# Altium schematic sheet 06-POWER SEQUENCE.SchDoc
size 513 x 386 mm
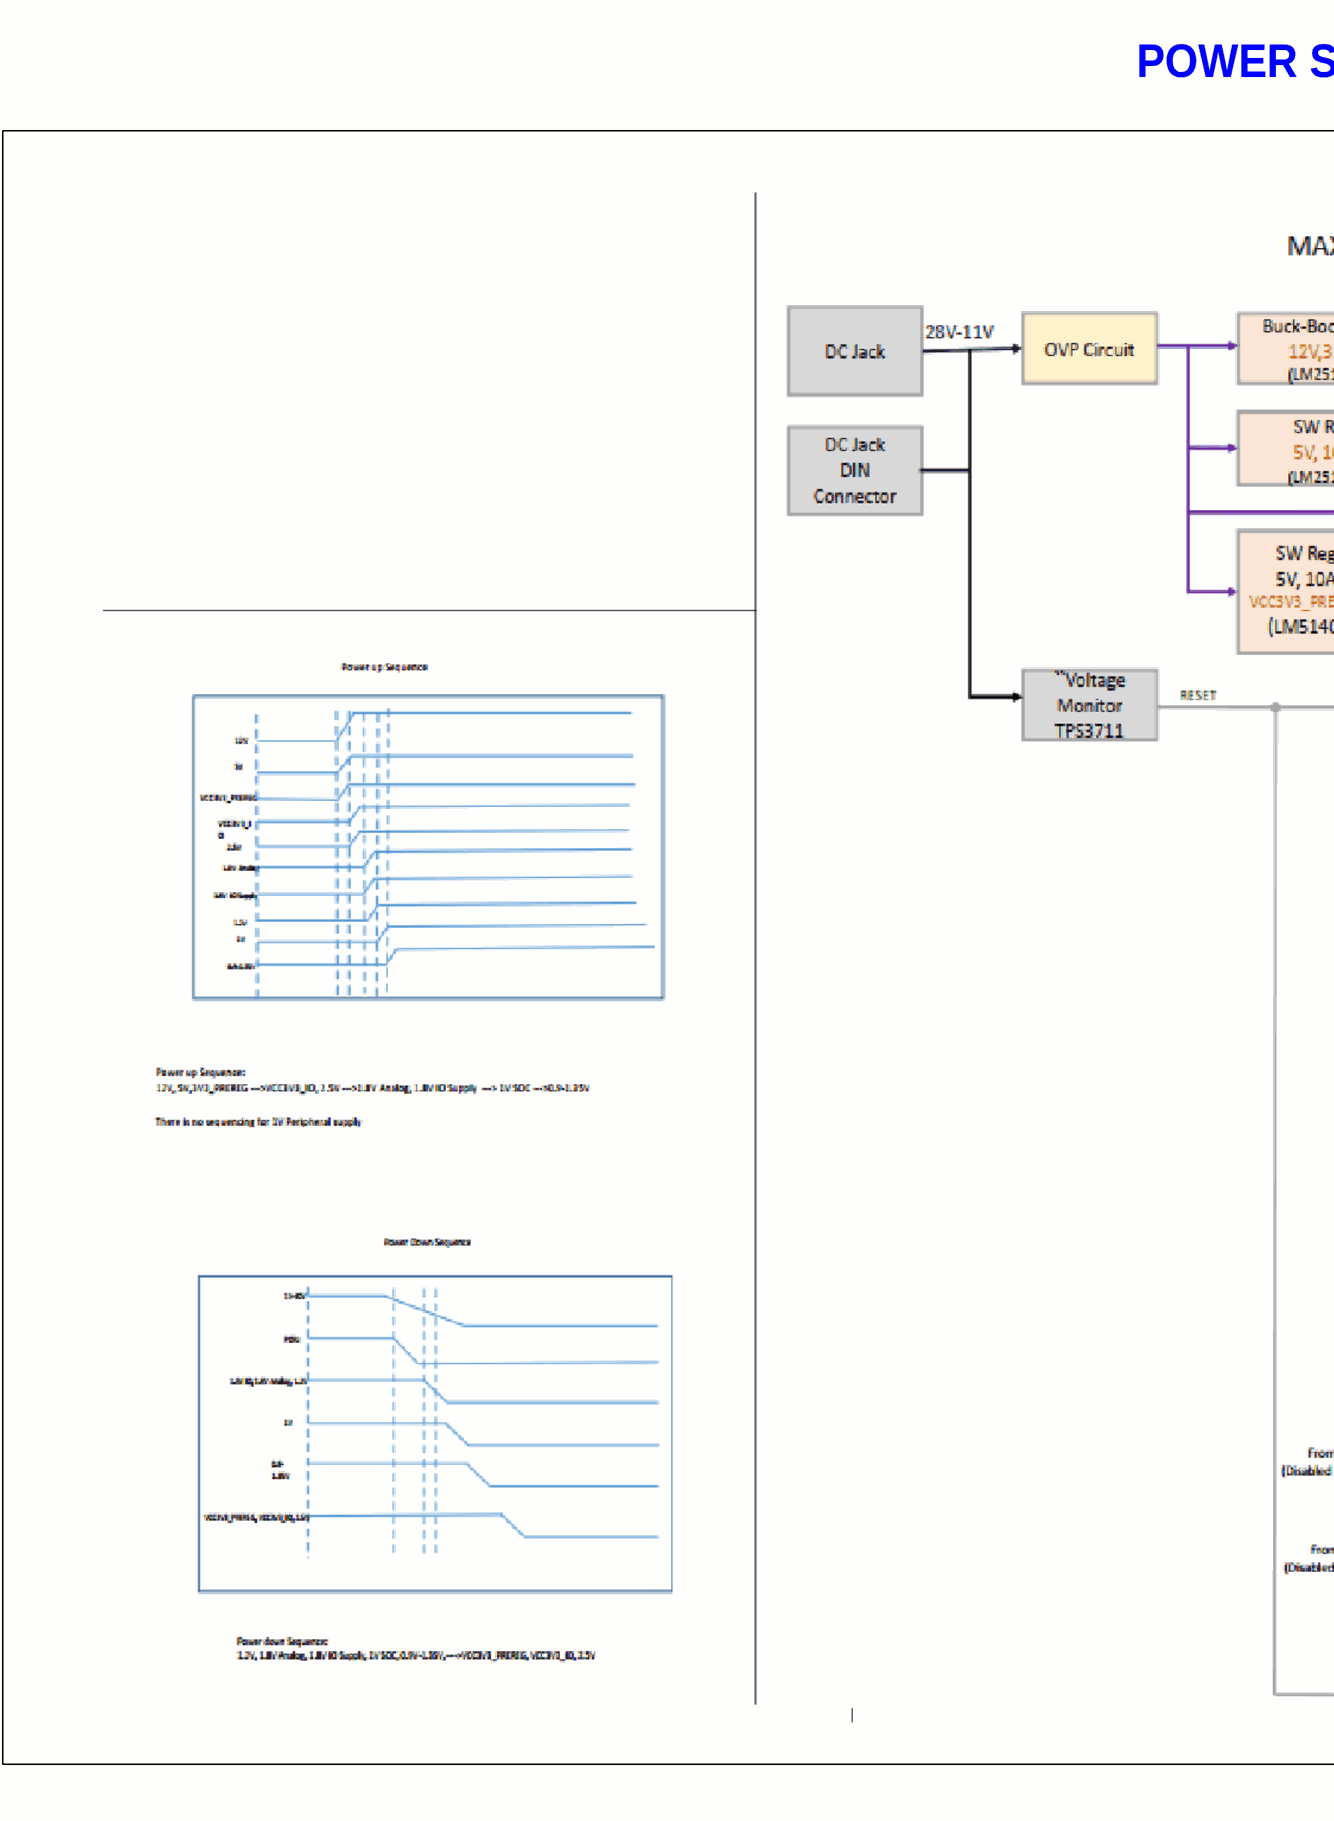
[diagram p0: 06-POWER SEQUENCE.SchDoc, left]
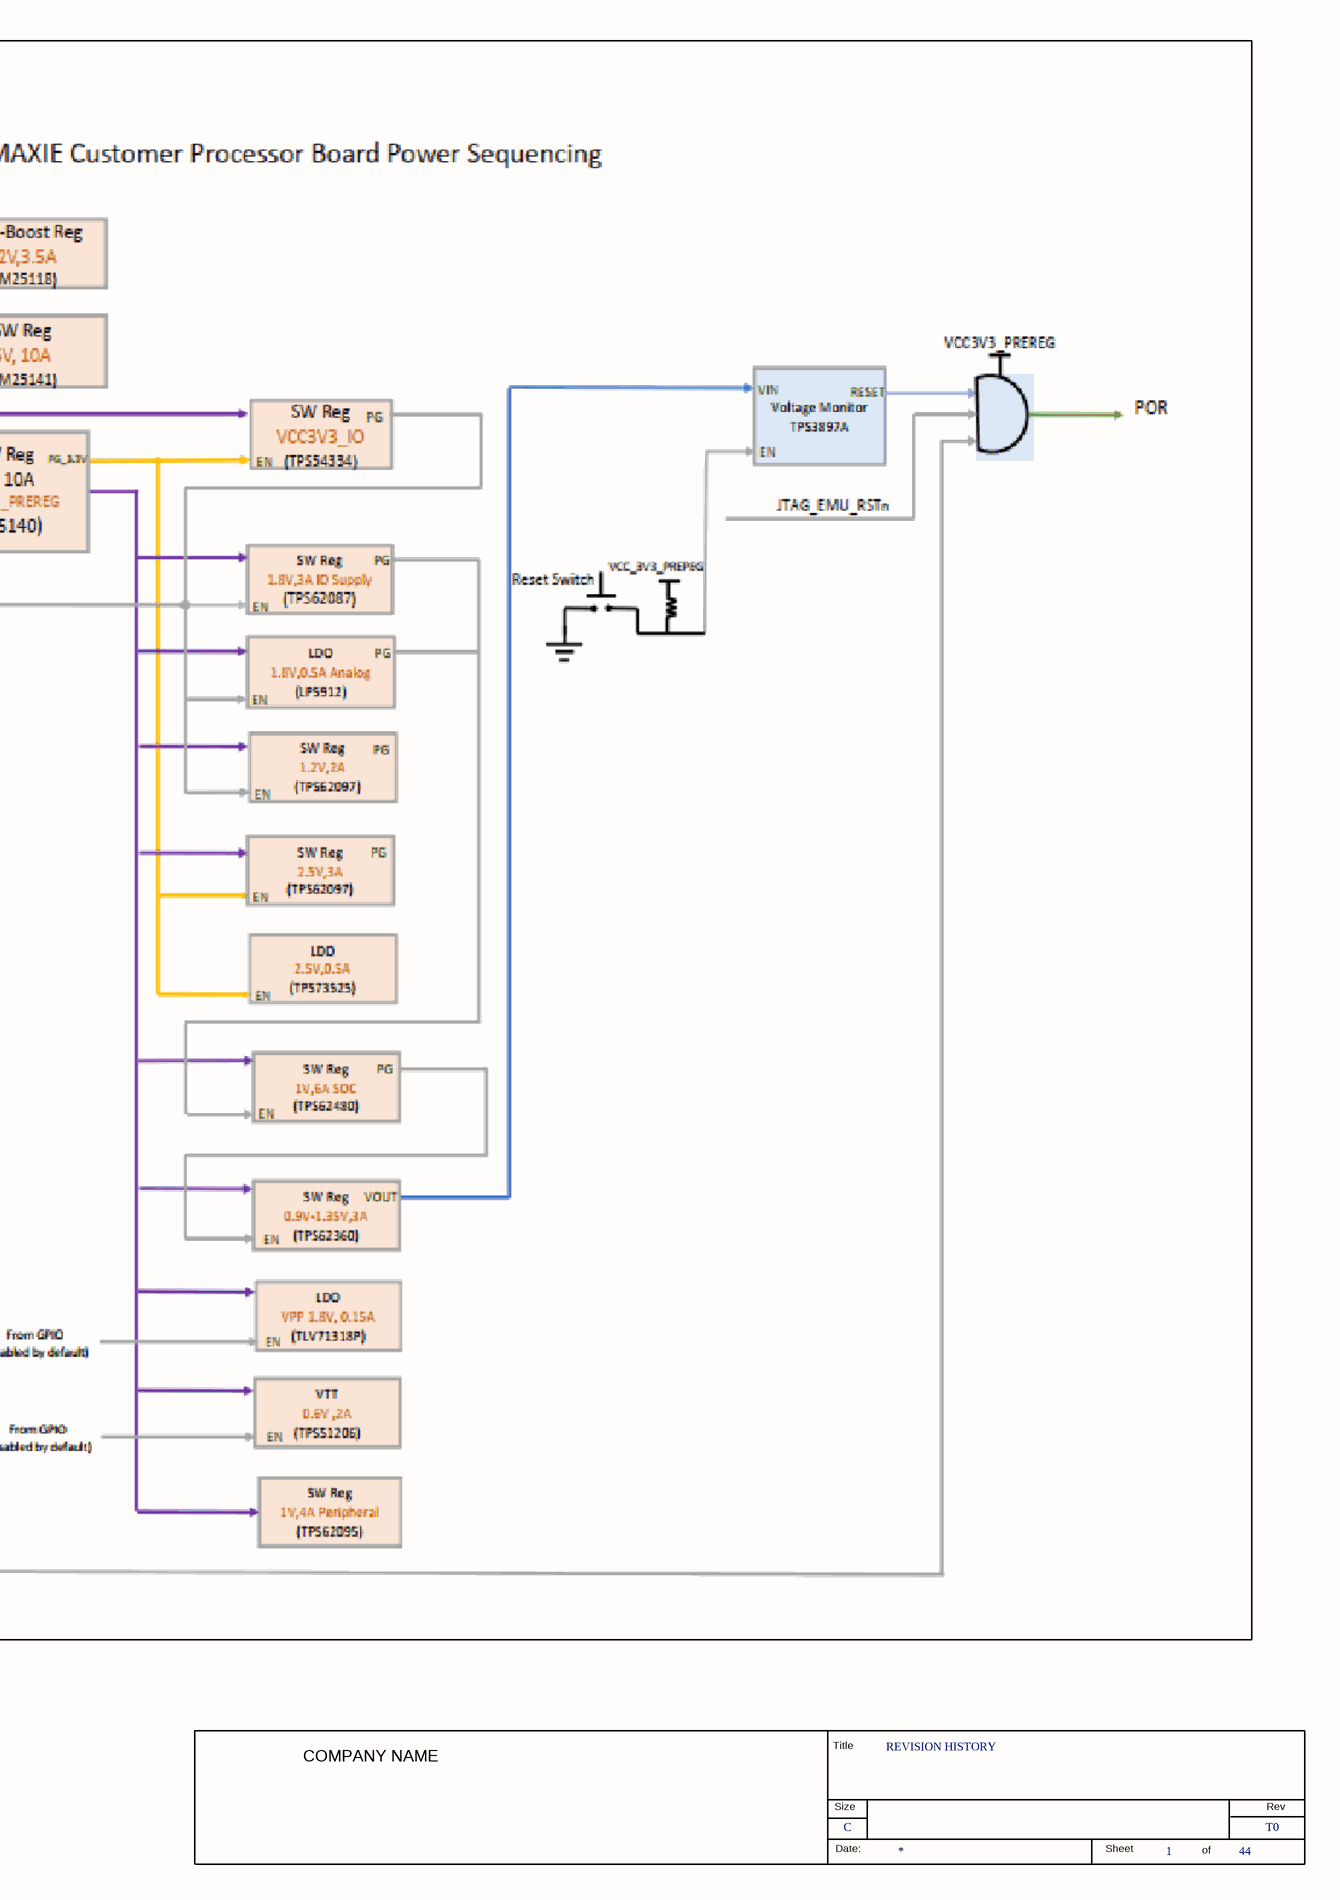
[diagram p1: 06-POWER SEQUENCE.SchDoc, right]

## Parts
*  RevCode: T0  Title: REVISION HISTORY  Page Size: C  Page Number: 1  Page Count: 44  (hidden comment: TRAINING_TITLEBLK_CSIZE)  (graphical)

## Notes on the sheet
- POWER SEQUENCE
- (in symbol TRAINING_TITLEBLK_CSIZE) Title; COMPANY NAME; Size; Rev; Date:; Sheet; of

## Library data of the parts
* = TRAINING_TITLEBLK_CSIZE: Issue: 1.0; Page Create Date: Jan  8, 2022; Page Modify Date: *